# EAGLE schematic Implant 4.4 (EAGLE 7.3.0)
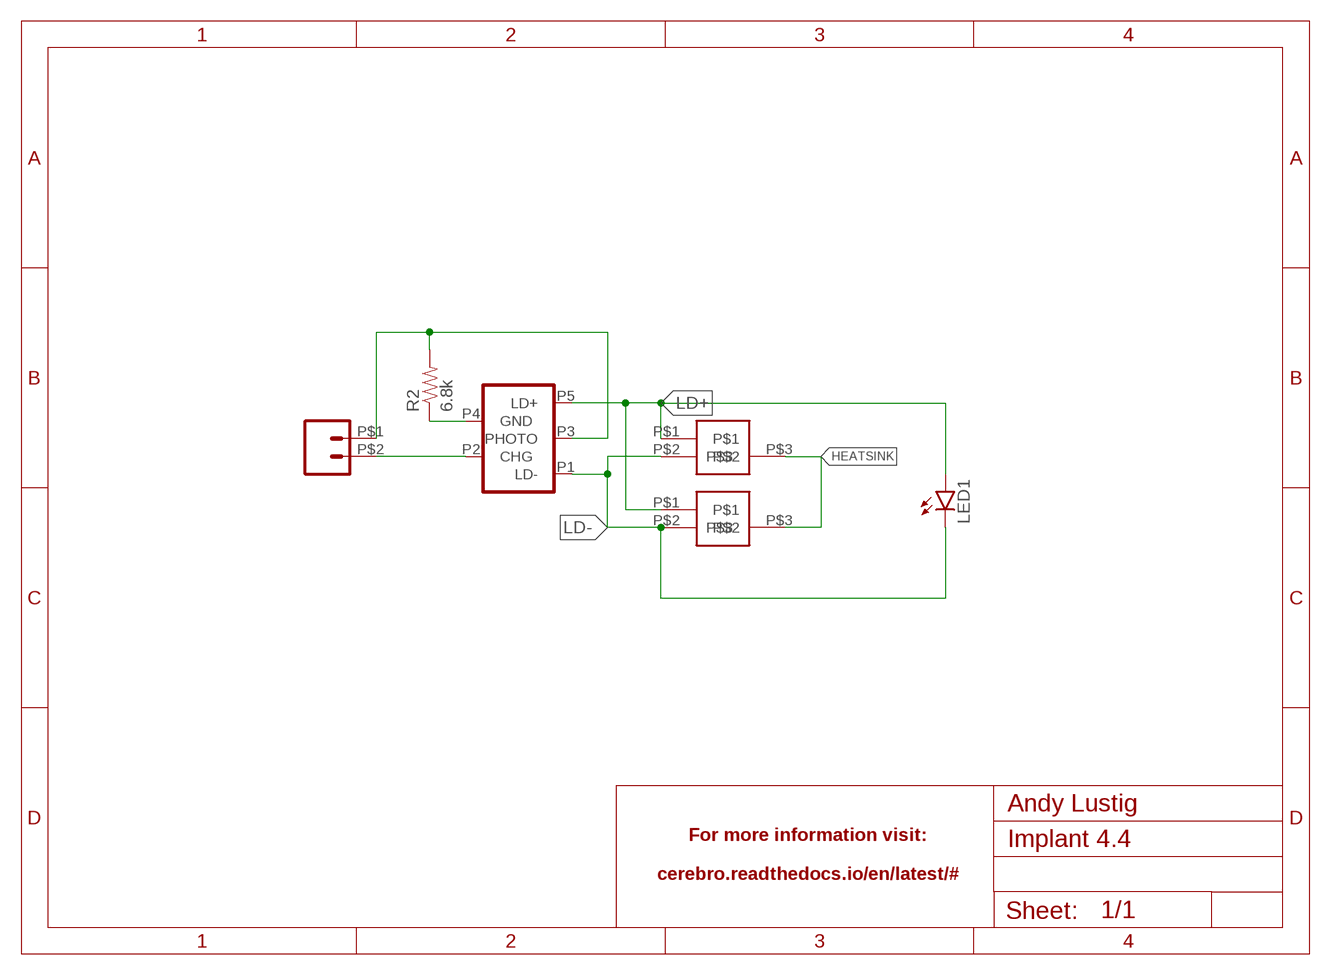
[diagram p0: schematic, sheet 1]

## Parts
JP1  M02SMALL  [1X02_SMALL]
LED1  LED10MM  [LED10MM]
R2  6.8k  RESISTOR0805-RES  [0805]
U$1  LASERDIODE  [LASERDIODE]
U$2  USB_SOCKET_MICRO_VERT  [USB_VERT_MICRO_SMD]
U$3  LASERDIODE  [LASERDIODE]

## Nets
HEATSINK: U$1.P$3 U$3.P$3
LD+: LED1.A U$1.P$1 U$2.P5(LD+) U$3.P$1
LD-: LED1.C U$1.P$2 U$2.P1(LD-) U$3.P$2
N$1: R2.1 U$2.P4(GND)
N$3: JP1.P$2 U$2.P2(CHG)
N$4: JP1.P$1 R2.2 U$2.P3(PHOTO)

## Library data of the parts
JP1 = SparkFun-Connectors:M02: Standard 2-pin 0.1" header. Use with - straight break away headers ( PRT-00116) - right angle break away headers (PRT-00553) - swiss pins (PRT-00743) - machine pins (PRT-00117) - female headers (PRT-00115) Molex polarized connector foot print use with: PRT-08233 with associated crimp pins and housings. 2.54_SCREWTERM for use with PRT-10571. 3.5mm Screw Terminal footprints for PRT-08084 5mm Screw Terminal footprints for use with PRT-08432
LED1 = Andy-library:LED: LEDs Standard schematic elements and footprints for 5mm, 3mm, 1206, and 0603 sized LEDs. 5mm - Spark Fun Electronics SKU : COM-00529 (and others)
R2 = Andy-library:RESISTOR: Resistor Basic schematic elements and footprints for 0603, 1206, and PTH resistors.
U$1 U$3 = Andy-library:LASERDIODE
U$2 = Andy-library:USB_SOCKET_MICRO_VERT